# Altium schematic sheet modFOC-Motion_Controller.SchDoc: modFOC-Motion_Controller
size A4; Date: dssd; Author: Mathias Giller; CompanyName: HTL St. Pölten; Address1: modFOC; DocumentNumber: 1; Revision: 2.0; SheetNumber: 1; SheetTotal: 5
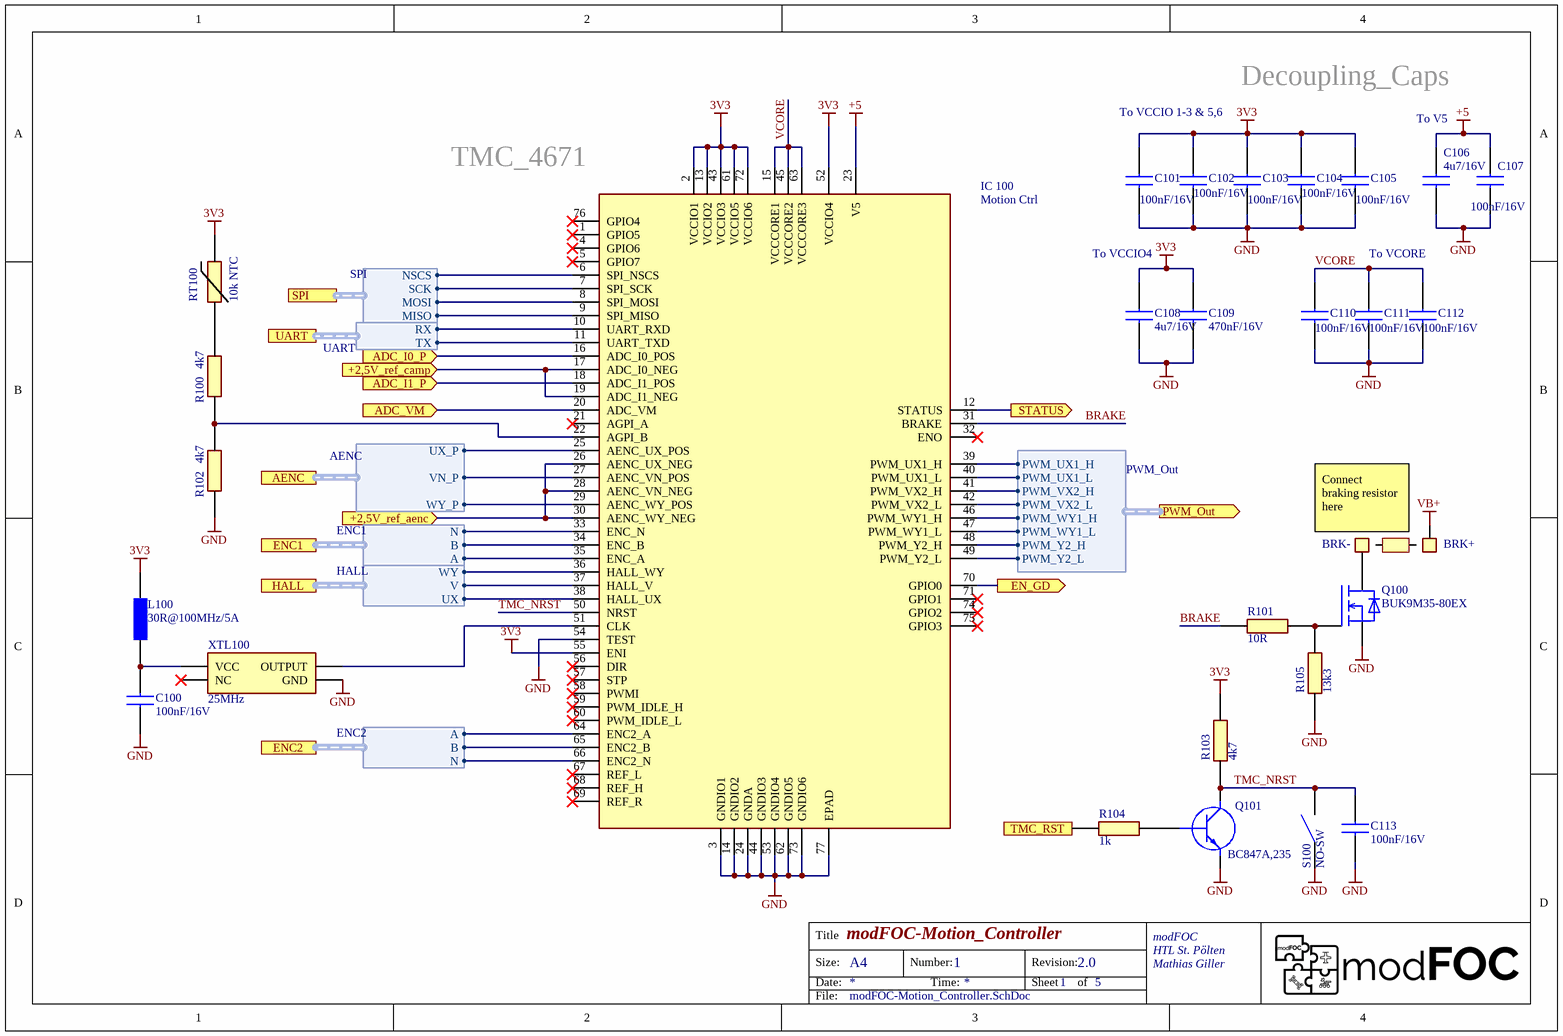
[diagram p0: modFOC-Motion_Controller.SchDoc]

## Parts
BRK+  PW_PAD_SMOL  [PW_PAD_SMOL]  (value not drawn)
BRK-  PW_PAD_SMOL  [PW_PAD_SMOL]  (value not drawn)
C100  100nF/16V  [CAPC1608X97N]
C101  100nF/16V  [CAPC1608X97N]
C102  100nF/16V  [CAPC1608X97N]
C103  100nF/16V  [CAPC1608X97N]
C104  100nF/16V  [CAPC1608X97N]
C105  100nF/16V  [CAPC1608X97N]
C106  4u7/16V  [CAPC1608X97N]
C107  100nF/16V  [CAPC1608X97N]
C108  4u7/16V  [CAPC1608X97N]
C109  470nF/16V  [CAPC1608X97N]
C110  100nF/16V  [CAPC1608X97N]
C111  100nF/16V  [CAPC1608X97N]
C112  100nF/16V  [CAPC1608X97N]
C113  100nF/16V  [CAPC1608X97N]
IC_100  Motion Ctrl  [QFN40P1050X650X90-77N]
L100  30R@100MHz/5A  [BLM18KG101TH1D]
Q100  BUK9M35-80EX  [BUK7M1260E]
Q101  BC847A,235  [SOT95P230X110-3N]
R100  4k7  [RESC1608X55N]
R101  10R  [RESC1608X55N]
R102  4k7  [RESC1608X55N]
R103  4k7  [RESC1608X55N]
R104  1k  [RESC1608X55N]
R105  13k3  [RESC1608X55N]
RT100  10k NTC  [THRMC1608X95N]
S100  NO-SW  [PTS647SM50SMTR2LFS]
XTL100  25MHz  [FOX924B25]

## Ports
+2,5V_ref_aenc (in), +2,5V_ref_camp (in), ADC_I0_P (in), ADC_I1_P (in), ADC_VM (in), AENC (harness AENC), EN_GD (out), ENC1 (harness ENC1), ENC2 (harness ENC2), HALL (harness HALL), PWM_Out (out, harness PWM_Out), SPI (harness SPI), STATUS (out), TMC_RST (in), UART (harness UART)

## Harnesses
PWM_Out: PWM_UX1_H, PWM_UX1_L, PWM_VX2_H, PWM_VX2_L, PWM_WY1_H, PWM_WY1_L, PWM_Y2_H, PWM_Y2_L
UART: RX, TX
AENC: UX_P, VN_P, WY_P
ENC1: N, B, A
HALL: WY, V, UX
ENC2: A, B, N
SPI: NSCS, SCK, MOSI, MISO

## Nets
3V3: C101.2 C102.2 C103.2 C104.2 C105.2 C108.2 C109.1 IC_100.2(VCCIO1) IC_100.13(VCCIO2) IC_100.43(VCCIO3) IC_100.52(VCCIO4) IC_100.55(ENI) IC_100.61(VCCIO5) IC_100.72(VCCIO6) L100.1 R103.2 RT100.1
+5: C106.2 C107.1 IC_100.23(V5)
GND: C100.1 C101.1 C102.1 C103.1 C104.1 C105.1 C106.1 C107.2 C108.1 C109.2 C110.2 C111.2 C112.2 C113.1 IC_100.3(GNDIO1) IC_100.14(GNDIO2) IC_100.24(GNDA) IC_100.44(GNDIO3) IC_100.53(GNDIO4) IC_100.54(TEST) IC_100.62(GNDIO5) IC_100.73(GNDIO6) IC_100.77(EPAD) Q100.1,2,3(S) Q101.2(E) R102.1 R105.2 S100.1,2 XTL100.2(GND)
VB+: BRK+.1
+2,5V_ref_aenc: IC_100.26(AENC_UX_NEG) IC_100.28(AENC_VN_NEG) IC_100.30(AENC_WY_NEG) ; port +2,5V_ref_aenc
+2,5V_ref_camp: IC_100.17(ADC_I0_NEG) IC_100.19(ADC_I1_NEG) ; port +2,5V_ref_camp
ADC_I0_P: IC_100.16(ADC_I0_POS) ; port ADC_I0_P
ADC_I1_P: IC_100.18(ADC_I1_POS) ; port ADC_I1_P
ADC_VM: IC_100.20(ADC_VM) ; port ADC_VM
BRAKE: IC_100.31(BRAKE) R101.1
EN_GD: IC_100.70(GPIO0) ; port EN_GD
STATUS: IC_100.12(STATUS) ; port STATUS
TMC_NRST: C113.2 IC_100.50(NRST) Q101.3(C) R103.1 S100.3,4
TMC_RST: R104.2 ; port TMC_RST
VCORE: C110.1 C111.1 C112.1 IC_100.15(VCCCORE1) IC_100.45(VCCCORE2) IC_100.63(VCCCORE3)
NetBRK-_1: BRK-.1 Q100.5,6,7,8,9(D)
NetC100_2: C100.2 L100.2 XTL100.4(VCC)
NetIC_100_6: IC_100.6(SPI_NSCS) ; port SPI.NSCS
NetIC_100_7: IC_100.7(SPI_SCK) ; port SPI.SCK
NetIC_100_8: IC_100.8(SPI_MOSI) ; port SPI.MOSI
NetIC_100_9: IC_100.9(SPI_MISO) ; port SPI.MISO
NetIC_100_10: IC_100.10(UART_RXD) ; port UART.RX
NetIC_100_11: IC_100.11(UART_TXD) ; port UART.TX
NetIC_100_22: IC_100.22(AGPI_B) R100.1 R102.2
NetIC_100_25: IC_100.25(AENC_UX_POS) ; port AENC.UX_P
NetIC_100_27: IC_100.27(AENC_VN_POS) ; port AENC.VN_P
NetIC_100_29: IC_100.29(AENC_WY_POS) ; port AENC.WY_P
NetIC_100_33: IC_100.33(ENC_N) ; port ENC1.N
NetIC_100_34: IC_100.34(ENC_B) ; port ENC1.B
NetIC_100_35: IC_100.35(ENC_A) ; port ENC1.A
NetIC_100_36: IC_100.36(HALL_WY) ; port HALL.WY
NetIC_100_37: IC_100.37(HALL_V) ; port HALL.V
NetIC_100_38: IC_100.38(HALL_UX) ; port HALL.UX
NetIC_100_39: IC_100.39(PWM_UX1_H) ; port PWM_Out.PWM_UX1_H
NetIC_100_40: IC_100.40(PWM_UX1_L) ; port PWM_Out.PWM_UX1_L
NetIC_100_41: IC_100.41(PWM_VX2_H) ; port PWM_Out.PWM_VX2_H
NetIC_100_42: IC_100.42(PWM_VX2_L) ; port PWM_Out.PWM_VX2_L
NetIC_100_46: IC_100.46(PWM_WY1_H) ; port PWM_Out.PWM_WY1_H
NetIC_100_47: IC_100.47(PWM_WY1_L) ; port PWM_Out.PWM_WY1_L
NetIC_100_48: IC_100.48(PWM_Y2_H) ; port PWM_Out.PWM_Y2_H
NetIC_100_49: IC_100.49(PWM_Y2_L) ; port PWM_Out.PWM_Y2_L
NetIC_100_51: IC_100.51(CLK) XTL100.3(OUTPUT)
NetIC_100_64: IC_100.64(ENC2_A) ; port ENC2.A
NetIC_100_65: IC_100.65(ENC2_B) ; port ENC2.B
NetIC_100_66: IC_100.66(ENC2_N) ; port ENC2.N
NetQ100_4: Q100.4(G) R101.2 R105.1
NetQ101_1: Q101.1(B) R104.1
NetR100_2: R100.2 RT100.2

Not connected (* = marked no-connect by the designer): IC_100 1(GPIO5)* 4(GPIO6)* 5(GPIO7)* 21(AGPI_A)* 32(ENO)* 56(DIR)* 57(STP)* 58(PWMI)* 59(PWM_IDLE_H)* 60(PWM_IDLE_L)* 67(REF_L)* 68(REF_H)* 69(REF_R)* 71(GPIO1)* 74(GPIO2)* 75(GPIO3)* 76(GPIO4)*; XTL100 1(NC)*

## Notes on the sheet
- To VCCIO 1-3 & 5,6
- Decoupling_Caps
- (near IC_100) TMC_4671
- To V5
- To VCCIO4
- To VCORE
- Connect
  braking resistor
  here
- Title
- Size:
- Date:
- A4
- Number:
- Time:
- Revision:
- Sheet
- of
- File:

## Library data of the parts
C100-C113 = C0603: Capacitor
IC_100 = TMC4671-LA IC: FOC Motion Controller; Manufacturer_Name: Trinamic; Manufacturer_Part_Number: TMC4671-LA
L100 = BLM18KG300TH1D: Ferrite Bead; Manufacturer_Name: Murata Electronics; Datasheet Link: https://www.murata.com/en-us/products/productdetail?partno=BLM18KG300TH1%23; Height: 0.75mm; Manufacturer_Part_Number: BLM18KG300TH1D; Arrow Part Number: BLM18KG300TH1D; Arrow Price/Stock: https://www.arrow.com/en/products/blm18kg300th1d/murata-manufacturing; Mouser Part Number: 81-BLM18KG300TH1D; Mouser Price/Stock: https://www.mouser.com/Search/Refine.aspx?Keyword=81-BLM18KG300TH1D
Q100 = BUK9M35-80EX: MOSFET (N-Channel); Manufacturer_Name: Nexperia; Datasheet Link: https://assets.nexperia.com/documents/data-sheet/BUK9M35-80E.pdf; Manufacturer_Part_Number: BUK9M35-80EX; Mouser Part Number: 771-BUK9M35-80EX; Mouser Price/Stock: https://www.mouser.com/Search/Refine.aspx?Keyword=771-BUK9M35-80EX; Arrow Part Number: BUK9M35-80EX; Arrow Price/Stock: https://www.arrow.com/en/products/buk9m35-80ex/nexperia
Q101 = BC847A,235: Transistor BJT NPN; Manufacturer_Name: Nexperia; Datasheet Link: http://assets.nexperia.com/documents/data-sheet/BC847_SER.pdf; Height: 1.1mm; Manufacturer_Part_Number: BC847A,235; Mouser Part Number: 771-BC847A235; Mouser Price/Stock: https://www.mouser.co.uk/ProductDetail/Nexperia/BC847A235?qs=me8TqzrmIYWeD%252BqPzufrRA%3D%3D; Arrow Part Number: BC847A,235; Arrow Price/Stock: https://www.arrow.com/en/products/bc847a235/nexperia
R100-R105 = R0603: Resistor
RT100 = NCP18XH103F03RB: Thermistor; Manufacturer_Name: Murata Electronics; Datasheet Link: https://componentsearchengine.com/Datasheets/2/NCP18XH103F03RB.pdf; Height: 0.95mm; Manufacturer_Part_Number: NCP18XH103F03RB; Mouser Part Number: 81-NCP18XH103F03RB; Mouser Price/Stock: https://www.mouser.co.uk/ProductDetail/Murata-Electronics/NCP18XH103F03RB?qs=k3rQb2PKXqkF9YvF09qsvw%3D%3D; Arrow Part Number: NCP18XH103F03RB; Arrow Price/Stock: https://www.arrow.com/en/products/ncp18xh103f03rb/murata-manufacturing?region=europe
S100 = PTS647SM50SMTR2LFS: Switch; Manufacturer_Name: C & K COMPONENTS; Datasheet Link: https://www.ckswitches.com/media/2567/pts647.pdf; Height: 5.25mm; Manufacturer_Part_Number: PTS647SM50SMTR2LFS; Mouser Part Number: 611-PTS647SM50SMTR2L; Mouser Price/Stock: https://www.mouser.co.uk/ProductDetail/CK/PTS647SM50SMTR2LFS?qs=PqoDHHvF64%252BjK4ZB7f42kw%3D%3D; Arrow Part Number: PTS647SM50SMTR2LFS; Arrow Price/Stock: https://www.arrow.com/en/products/pts-647-sm50-smtr2-lfs/ck?region=nac
XTL100 = FOX924B-25: 25Mhz Oscillator; Manufacturer_Name: FOX; Manufacturer_Part_Number: FOX924B-25